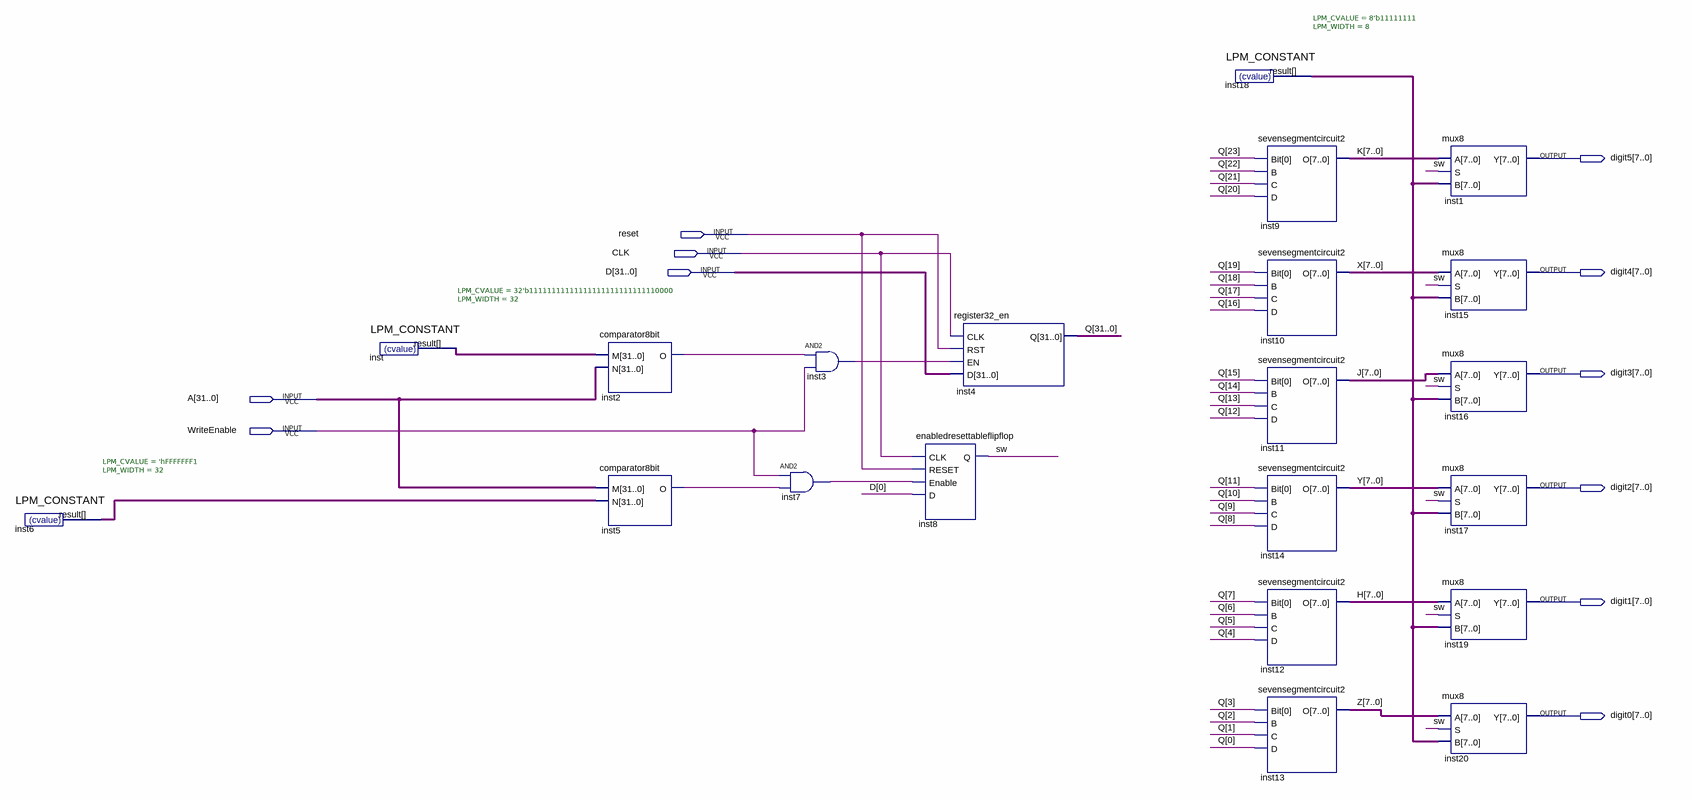
[diagram p0: schematic sheet]
// Quartus schematic displayDriver.bdf as structural Verilog: 21 symbols, 11 pins
module displayDriver (
  input  reset,
  input  CLK,
  input  [31:0] D,
  input  [31:0] A,
  input  WriteEnable,
  output [7:0] digit5,
  output [7:0] digit4,
  output [7:0] digit3,
  output [7:0] digit2,
  output [7:0] digit1,
  output [7:0] digit0
);

  wire inst2_o, inst3_out, inst5_o, inst7_out, sw;
  wire [7:0] H, inst18_result, J, K, X, Y, Z;
  wire [31:0] inst6_result, inst_result, Q;

  LPM_CONSTANT #(.LPM_CVALUE('hFFFFFFF1), .LPM_WIDTH(32)) inst6 (.result(inst6_result));
  LPM_CONSTANT #(.LPM_CVALUE(32'b11111111111111111111111111110000), .LPM_WIDTH(32)) inst (.result(inst_result));
  comparator8bit inst2 (.M(inst_result), .N(A), .O(inst2_o));
  comparator8bit inst5 (.M(A), .N(inst6_result), .O(inst5_o));
  and inst3 (inst3_out, inst2_o, WriteEnable);
  and inst7 (inst7_out, WriteEnable, inst5_o);
  enabledresettableflipflop inst8 (.CLK(CLK), .RESET(reset), .Enable(inst7_out), .D(D[0]), .Q(sw));
  register32_en inst4 (.CLK(CLK), .RST(reset), .EN(inst3_out), .D(D), .Q(Q));
  LPM_CONSTANT #(.LPM_CVALUE(8'b11111111), .LPM_WIDTH(8)) inst18 (.result(inst18_result));
  sevensegmentcircuit2 inst9 (.Bit(Q[23]), .B(Q[22]), .C(Q[21]), .D(Q[20]), .O(K));
  sevensegmentcircuit2 inst10 (.Bit(Q[19]), .B(Q[18]), .C(Q[17]), .D(Q[16]), .O(X));
  sevensegmentcircuit2 inst11 (.Bit(Q[15]), .B(Q[14]), .C(Q[13]), .D(Q[12]), .O(J));
  sevensegmentcircuit2 inst14 (.Bit(Q[11]), .B(Q[10]), .C(Q[9]), .D(Q[8]), .O(Y));
  sevensegmentcircuit2 inst12 (.Bit(Q[7]), .B(Q[6]), .C(Q[5]), .D(Q[4]), .O(H));
  sevensegmentcircuit2 inst13 (.Bit(Q[3]), .B(Q[2]), .C(Q[1]), .D(Q[0]), .O(Z));
  mux8 inst1 (.A(K), .S(sw), .B(inst18_result), .Y(digit5));
  mux8 inst15 (.A(X), .S(sw), .B(inst18_result), .Y(digit4));
  mux8 inst16 (.A(J), .S(sw), .B(inst18_result), .Y(digit3));
  mux8 inst17 (.A(Y), .S(sw), .B(inst18_result), .Y(digit2));
  mux8 inst19 (.A(H), .S(sw), .B(inst18_result), .Y(digit1));
  mux8 inst20 (.A(Z), .S(sw), .B(inst18_result), .Y(digit0));
endmodule
